# EAGLE design texboard (EAGLE 9.1.3)
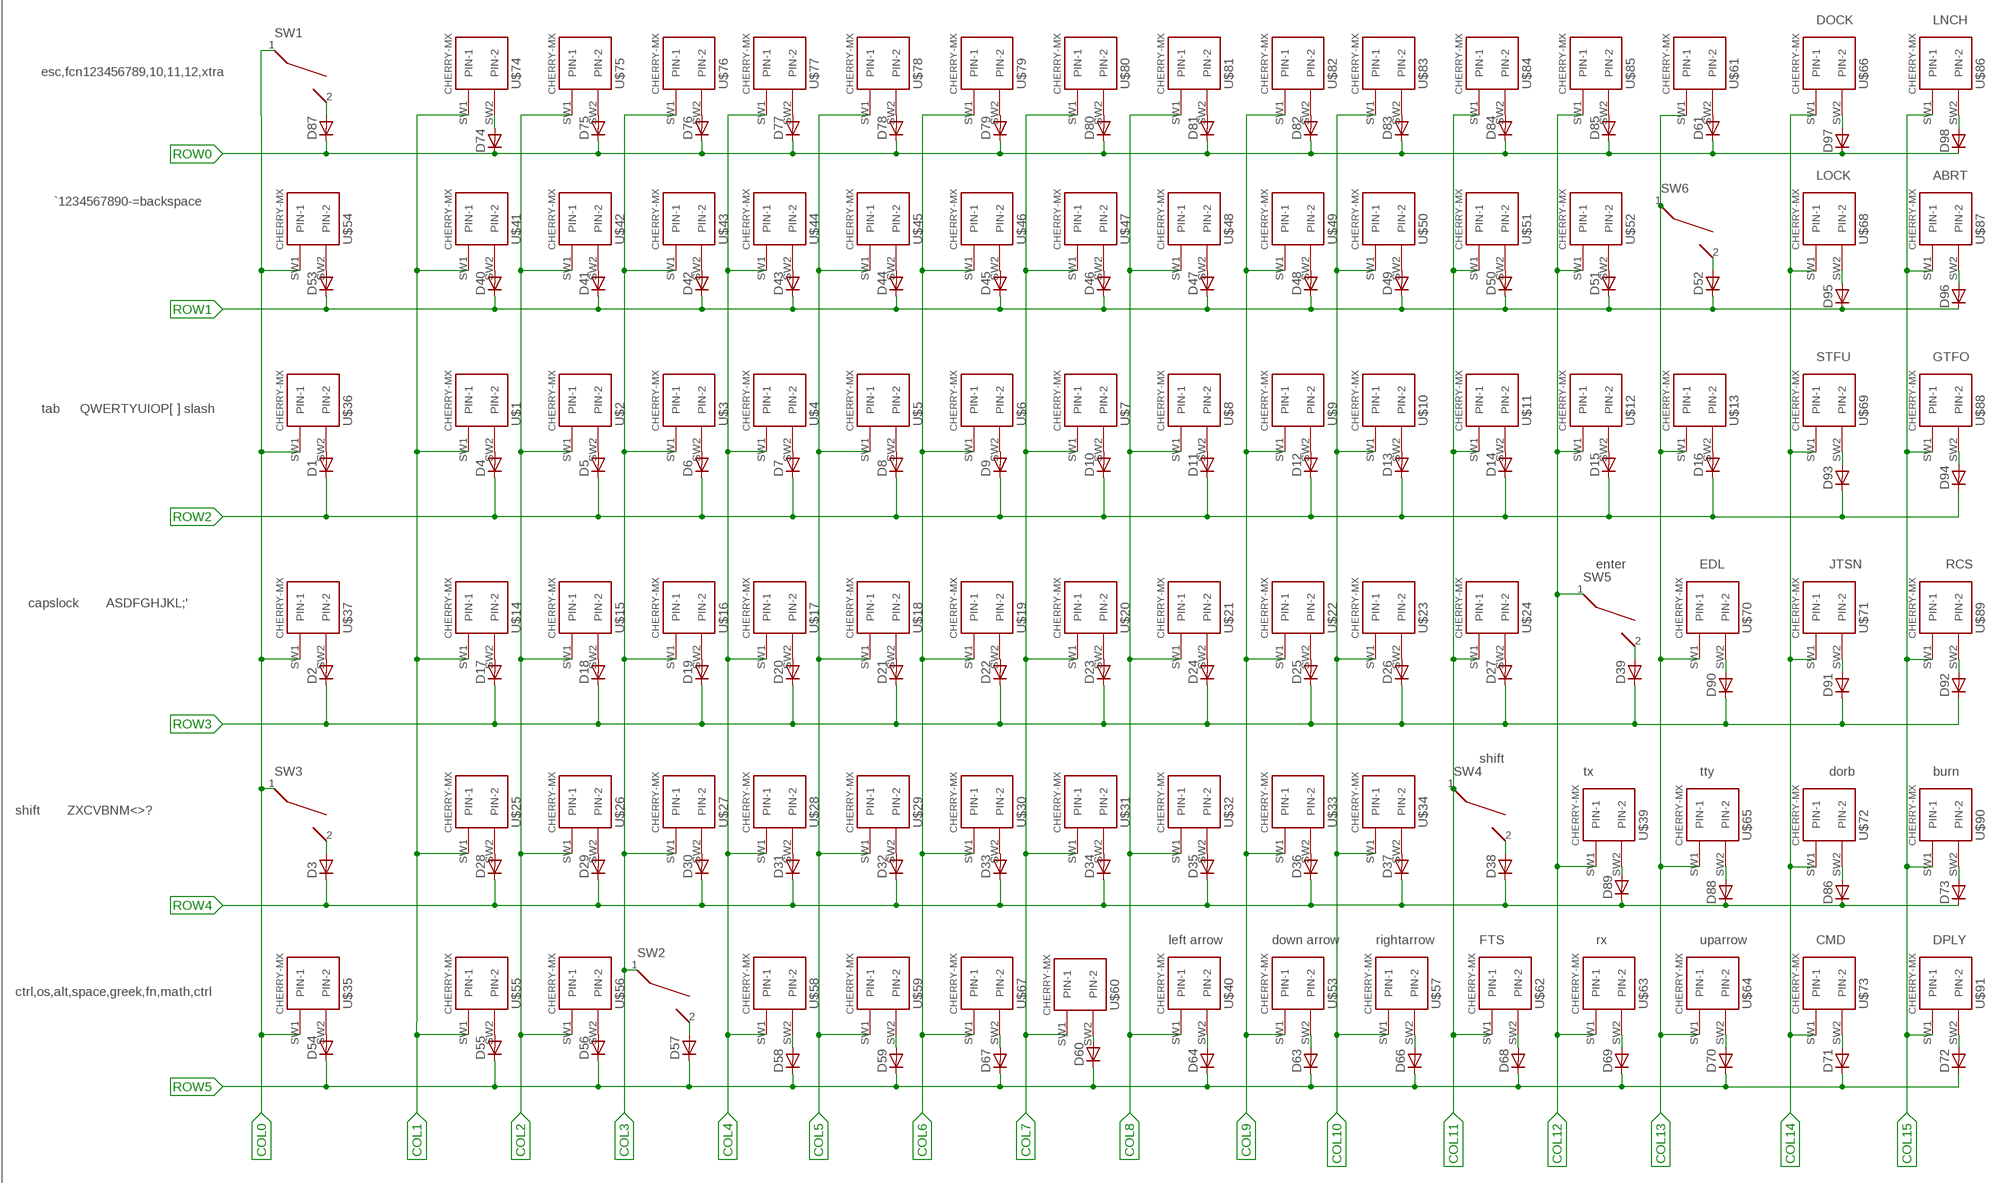
[diagram p0: schematic, sheet 1, part 1 of 2]
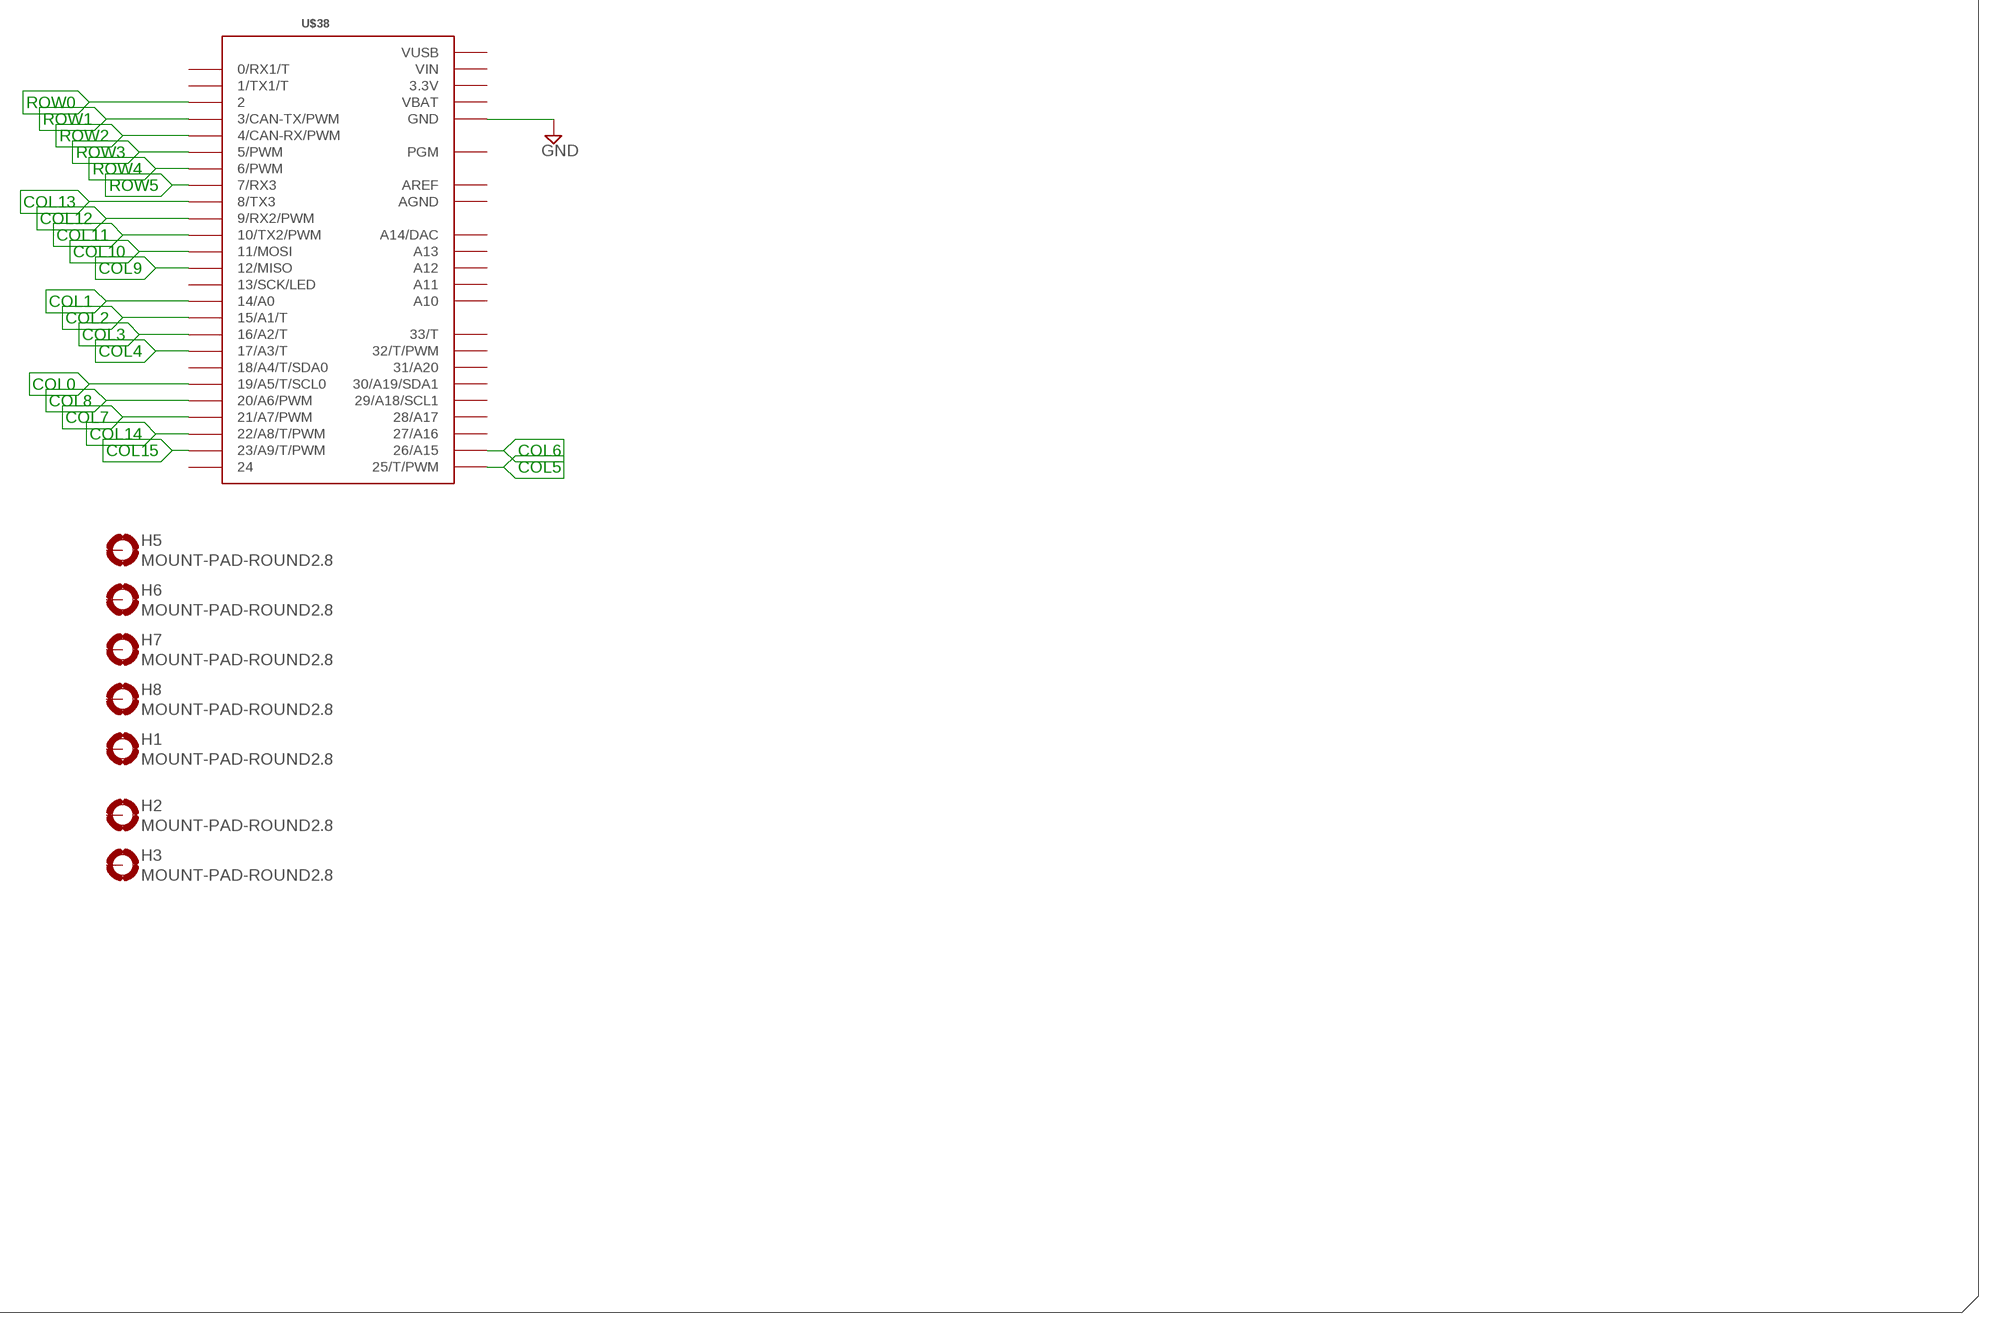
[diagram p1: schematic, sheet 1, part 2 of 2]

## Parts
D1  DIODE_E-DO35-7  [DIODE_DO35-7]
D2  DIODE_E-DO35-7  [DIODE_DO35-7]
D3  DIODE_E-DO35-7  [DIODE_DO35-7]
D4  DIODE_E-DO35-7  [DIODE_DO35-7]
D5  DIODE_E-DO35-7  [DIODE_DO35-7]
D6  DIODE_E-DO35-7  [DIODE_DO35-7]
D7  DIODE_E-DO35-7  [DIODE_DO35-7]
D8  DIODE_E-DO35-7  [DIODE_DO35-7]
D9  DIODE_E-DO35-7  [DIODE_DO35-7]
D10  DIODE_E-DO35-7  [DIODE_DO35-7]
D11  DIODE_E-DO35-7  [DIODE_DO35-7]
D12  DIODE_E-DO35-7  [DIODE_DO35-7]
D13  DIODE_E-DO35-7  [DIODE_DO35-7]
D14  DIODE_E-DO35-7  [DIODE_DO35-7]
D15  DIODE_E-DO35-7  [DIODE_DO35-7]
D16  DIODE_E-DO35-7  [DIODE_DO35-7]
D17  DIODE_E-DO35-7  [DIODE_DO35-7]
D18  DIODE_E-DO35-7  [DIODE_DO35-7]
D19  DIODE_E-DO35-7  [DIODE_DO35-7]
D20  DIODE_E-DO35-7  [DIODE_DO35-7]
D21  DIODE_E-DO35-7  [DIODE_DO35-7]
D22  DIODE_E-DO35-7  [DIODE_DO35-7]
D23  DIODE_E-DO35-7  [DIODE_DO35-7]
D24  DIODE_E-DO35-7  [DIODE_DO35-7]
D25  DIODE_E-DO35-7  [DIODE_DO35-7]
D26  DIODE_E-DO35-7  [DIODE_DO35-7]
D27  DIODE_E-DO35-7  [DIODE_DO35-7]
D28  DIODE_E-DO35-7  [DIODE_DO35-7]
D29  DIODE_E-DO35-7  [DIODE_DO35-7]
D30  DIODE_E-DO35-7  [DIODE_DO35-7]
D31  DIODE_E-DO35-7  [DIODE_DO35-7]
D32  DIODE_E-DO35-7  [DIODE_DO35-7]
D33  DIODE_E-DO35-7  [DIODE_DO35-7]
D34  DIODE_E-DO35-7  [DIODE_DO35-7]
D35  DIODE_E-DO35-7  [DIODE_DO35-7]
D36  DIODE_E-DO35-7  [DIODE_DO35-7]
D37  DIODE_E-DO35-7  [DIODE_DO35-7]
D38  DIODE_E-DO35-7  [DIODE_DO35-7]
D39  DIODE_E-DO35-7  [DIODE_DO35-7]
D40  DIODE_E-DO35-7  [DIODE_DO35-7]
D41  DIODE_E-DO35-7  [DIODE_DO35-7]
D42  DIODE_E-DO35-7  [DIODE_DO35-7]
D43  DIODE_E-DO35-7  [DIODE_DO35-7]
D44  DIODE_E-DO35-7  [DIODE_DO35-7]
D45  DIODE_E-DO35-7  [DIODE_DO35-7]
D46  DIODE_E-DO35-7  [DIODE_DO35-7]
D47  DIODE_E-DO35-7  [DIODE_DO35-7]
D48  DIODE_E-DO35-7  [DIODE_DO35-7]
D49  DIODE_E-DO35-7  [DIODE_DO35-7]
D50  DIODE_E-DO35-7  [DIODE_DO35-7]
D51  DIODE_E-DO35-7  [DIODE_DO35-7]
D52  DIODE_E-DO35-7  [DIODE_DO35-7]
D53  DIODE_E-DO35-7  [DIODE_DO35-7]
D54  DIODE_E-DO35-7  [DIODE_DO35-7]
D55  DIODE_E-DO35-7  [DIODE_DO35-7]
D56  DIODE_E-DO35-7  [DIODE_DO35-7]
D57  DIODE_E-DO35-7  [DIODE_DO35-7]
D58  DIODE_E-DO35-7  [DIODE_DO35-7]
D59  DIODE_E-DO35-7  [DIODE_DO35-7]
D60  DIODE_E-DO35-7  [DIODE_DO35-7]
D61  DIODE_E-DO35-7  [DIODE_DO35-7]
D63  DIODE_E-DO35-7  [DIODE_DO35-7]
D64  DIODE_E-DO35-7  [DIODE_DO35-7]
D66  DIODE_E-DO35-7  [DIODE_DO35-7]
D67  DIODE_E-DO35-7  [DIODE_DO35-7]
D68  DIODE_E-DO35-7  [DIODE_DO35-7]
D69  DIODE_E-DO35-7  [DIODE_DO35-7]
D70  DIODE_E-DO35-7  [DIODE_DO35-7]
D71  DIODE_E-DO35-7  [DIODE_DO35-7]
D72  DIODE_E-DO35-7  [DIODE_DO35-7]
D73  DIODE_E-DO35-7  [DIODE_DO35-7]
D74  DIODE_E-DO35-7  [DIODE_DO35-7]
D75  DIODE_E-DO35-7  [DIODE_DO35-7]
D76  DIODE_E-DO35-7  [DIODE_DO35-7]
D77  DIODE_E-DO35-7  [DIODE_DO35-7]
D78  DIODE_E-DO35-7  [DIODE_DO35-7]
D79  DIODE_E-DO35-7  [DIODE_DO35-7]
D80  DIODE_E-DO35-7  [DIODE_DO35-7]
D81  DIODE_E-DO35-7  [DIODE_DO35-7]
D82  DIODE_E-DO35-7  [DIODE_DO35-7]
D83  DIODE_E-DO35-7  [DIODE_DO35-7]
D84  DIODE_E-DO35-7  [DIODE_DO35-7]
D85  DIODE_E-DO35-7  [DIODE_DO35-7]
D86  DIODE_E-DO35-7  [DIODE_DO35-7]
D87  DIODE_E-DO35-7  [DIODE_DO35-7]
D88  DIODE_E-DO35-7  [DIODE_DO35-7]
D89  DIODE_E-DO35-7  [DIODE_DO35-7]
D90  DIODE_E-DO35-7  [DIODE_DO35-7]
D91  DIODE_E-DO35-7  [DIODE_DO35-7]
D92  DIODE_E-DO35-7  [DIODE_DO35-7]
D93  DIODE_E-DO35-7  [DIODE_DO35-7]
D94  DIODE_E-DO35-7  [DIODE_DO35-7]
D95  DIODE_E-DO35-7  [DIODE_DO35-7]
D96  DIODE_E-DO35-7  [DIODE_DO35-7]
D97  DIODE_E-DO35-7  [DIODE_DO35-7]
D98  DIODE_E-DO35-7  [DIODE_DO35-7]
H1  MOUNT-PAD-ROUND2.8  [2,8-PAD]
H2  MOUNT-PAD-ROUND2.8  [2,8-PAD]
H3  MOUNT-PAD-ROUND2.8  [2,8-PAD]
H5  MOUNT-PAD-ROUND2.8  [2,8-PAD]
H6  MOUNT-PAD-ROUND2.8  [2,8-PAD]
H7  MOUNT-PAD-ROUND2.8  [2,8-PAD]
H8  MOUNT-PAD-ROUND2.8  [2,8-PAD]
SW1  CHERRY_MX_STABILIZER_2X  [MX1A-XXNN_WITH_STABILIZER_2X]
SW2  CHERRY_MX_WITH_FIXING_PINS_&_STABILIZER_6.25X  [MX1A-XXNW_WITH_STABILIZER_6.25X]
SW3  CHERRY_MX_STABILIZER_2X  [MX1A-XXNN_WITH_STABILIZER_2X]
SW4  CHERRY_MX_STABILIZER_2X  [MX1A-XXNN_WITH_STABILIZER_2X]
SW5  CHERRY_MX_STABILIZER_2X  [MX1A-XXNN_WITH_STABILIZER_2X]
SW6  CHERRY_MX_STABILIZER_2X  [MX1A-XXNN_WITH_STABILIZER_2X]
U$1  CHERRY-MX  [CHERRY-MX]
U$2  CHERRY-MX  [CHERRY-MX]
U$3  CHERRY-MX  [CHERRY-MX]
U$4  CHERRY-MX  [CHERRY-MX]
U$5  CHERRY-MX  [CHERRY-MX]
U$6  CHERRY-MX  [CHERRY-MX]
U$7  CHERRY-MX  [CHERRY-MX]
U$8  CHERRY-MX  [CHERRY-MX]
U$9  CHERRY-MX  [CHERRY-MX]
U$10  CHERRY-MX  [CHERRY-MX]
U$11  CHERRY-MX  [CHERRY-MX]
U$12  CHERRY-MX  [CHERRY-MX]
U$13  CHERRY-MX  [CHERRY-MX]
U$14  CHERRY-MX  [CHERRY-MX]
U$15  CHERRY-MX  [CHERRY-MX]
U$16  CHERRY-MX  [CHERRY-MX]
U$17  CHERRY-MX  [CHERRY-MX]
U$18  CHERRY-MX  [CHERRY-MX]
U$19  CHERRY-MX  [CHERRY-MX]
U$20  CHERRY-MX  [CHERRY-MX]
U$21  CHERRY-MX  [CHERRY-MX]
U$22  CHERRY-MX  [CHERRY-MX]
U$23  CHERRY-MX  [CHERRY-MX]
U$24  CHERRY-MX  [CHERRY-MX]
U$25  CHERRY-MX  [CHERRY-MX]
U$26  CHERRY-MX  [CHERRY-MX]
U$27  CHERRY-MX  [CHERRY-MX]
U$28  CHERRY-MX  [CHERRY-MX]
U$29  CHERRY-MX  [CHERRY-MX]
U$30  CHERRY-MX  [CHERRY-MX]
U$31  CHERRY-MX  [CHERRY-MX]
U$32  CHERRY-MX  [CHERRY-MX]
U$33  CHERRY-MX  [CHERRY-MX]
U$34  CHERRY-MX  [CHERRY-MX]
U$35  CHERRY-MX  [CHERRY-MX]
U$36  CHERRY-MX  [CHERRY-MX]
U$37  CHERRY-MX  [CHERRY-MX]
U$38  TEENSY_3.1-3.2_ALL_PINS&PADS  [TEENSY_3.0-3.2_ALL_PINS_&_PADS]
U$39  CHERRY-MX  [CHERRY-MX]
U$40  CHERRY-MX  [CHERRY-MX]
U$41  CHERRY-MX  [CHERRY-MX]
U$42  CHERRY-MX  [CHERRY-MX]
U$43  CHERRY-MX  [CHERRY-MX]
U$44  CHERRY-MX  [CHERRY-MX]
U$45  CHERRY-MX  [CHERRY-MX]
U$46  CHERRY-MX  [CHERRY-MX]
U$47  CHERRY-MX  [CHERRY-MX]
U$48  CHERRY-MX  [CHERRY-MX]
U$49  CHERRY-MX  [CHERRY-MX]
U$50  CHERRY-MX  [CHERRY-MX]
U$51  CHERRY-MX  [CHERRY-MX]
U$52  CHERRY-MX  [CHERRY-MX]
U$53  CHERRY-MX  [CHERRY-MX]
U$54  CHERRY-MX  [CHERRY-MX]
U$55  CHERRY-MX  [CHERRY-MX]
U$56  CHERRY-MX  [CHERRY-MX]
U$57  CHERRY-MX  [CHERRY-MX]
U$58  CHERRY-MX  [CHERRY-MX]
U$59  CHERRY-MX  [CHERRY-MX]
U$60  CHERRY-MX  [CHERRY-MX]
U$61  CHERRY-MX  [CHERRY-MX]
U$62  CHERRY-MX  [CHERRY-MX]
U$63  CHERRY-MX  [CHERRY-MX]
U$64  CHERRY-MX  [CHERRY-MX]
U$65  CHERRY-MX  [CHERRY-MX]
U$66  CHERRY-MX  [CHERRY-MX]
U$67  CHERRY-MX  [CHERRY-MX]
U$68  CHERRY-MX  [CHERRY-MX]
U$69  CHERRY-MX  [CHERRY-MX]
U$70  CHERRY-MX  [CHERRY-MX]
U$71  CHERRY-MX  [CHERRY-MX]
U$72  CHERRY-MX  [CHERRY-MX]
U$73  CHERRY-MX  [CHERRY-MX]
U$74  CHERRY-MX  [CHERRY-MX]
U$75  CHERRY-MX  [CHERRY-MX]
U$76  CHERRY-MX  [CHERRY-MX]
U$77  CHERRY-MX  [CHERRY-MX]
U$78  CHERRY-MX  [CHERRY-MX]
U$79  CHERRY-MX  [CHERRY-MX]
U$80  CHERRY-MX  [CHERRY-MX]
U$81  CHERRY-MX  [CHERRY-MX]
U$82  CHERRY-MX  [CHERRY-MX]
U$83  CHERRY-MX  [CHERRY-MX]
U$84  CHERRY-MX  [CHERRY-MX]
U$85  CHERRY-MX  [CHERRY-MX]
U$86  CHERRY-MX  [CHERRY-MX]
U$87  CHERRY-MX  [CHERRY-MX]
U$88  CHERRY-MX  [CHERRY-MX]
U$89  CHERRY-MX  [CHERRY-MX]
U$90  CHERRY-MX  [CHERRY-MX]
U$91  CHERRY-MX  [CHERRY-MX]

## Nets
COL0: SW1.1 SW3.1 U$35.SW1(PIN-1) U$36.SW1(PIN-1) U$37.SW1(PIN-1) U$38.19/A5(19/A5/T/SCL0) U$54.SW1(PIN-1)
COL1: U$1.SW1(PIN-1) U$14.SW1(PIN-1) U$25.SW1(PIN-1) U$38.14/A0 U$41.SW1(PIN-1) U$55.SW1(PIN-1) U$74.SW1(PIN-1)
COL2: U$2.SW1(PIN-1) U$15.SW1(PIN-1) U$26.SW1(PIN-1) U$38.15/A1(15/A1/T) U$42.SW1(PIN-1) U$56.SW1(PIN-1) U$75.SW1(PIN-1)
COL3: SW2.1 U$3.SW1(PIN-1) U$16.SW1(PIN-1) U$27.SW1(PIN-1) U$38.16/A2(16/A2/T) U$43.SW1(PIN-1) U$76.SW1(PIN-1)
COL4: U$4.SW1(PIN-1) U$17.SW1(PIN-1) U$28.SW1(PIN-1) U$38.17/A3(17/A3/T) U$44.SW1(PIN-1) U$58.SW1(PIN-1) U$77.SW1(PIN-1)
COL5: U$5.SW1(PIN-1) U$18.SW1(PIN-1) U$29.SW1(PIN-1) U$38.25(25/T/PWM) U$45.SW1(PIN-1) U$59.SW1(PIN-1) U$78.SW1(PIN-1)
COL6: U$6.SW1(PIN-1) U$19.SW1(PIN-1) U$30.SW1(PIN-1) U$38.26(26/A15) U$46.SW1(PIN-1) U$67.SW1(PIN-1) U$79.SW1(PIN-1)
COL7: U$7.SW1(PIN-1) U$20.SW1(PIN-1) U$31.SW1(PIN-1) U$38.21/A7(21/A7/PWM) U$47.SW1(PIN-1) U$60.SW1(PIN-1) U$80.SW1(PIN-1)
COL8: U$8.SW1(PIN-1) U$21.SW1(PIN-1) U$32.SW1(PIN-1) U$38.20/A6(20/A6/PWM) U$40.SW1(PIN-1) U$48.SW1(PIN-1) U$81.SW1(PIN-1)
COL9: U$9.SW1(PIN-1) U$22.SW1(PIN-1) U$33.SW1(PIN-1) U$38.12(12/MISO) U$49.SW1(PIN-1) U$53.SW1(PIN-1) U$82.SW1(PIN-1)
COL10: U$10.SW1(PIN-1) U$23.SW1(PIN-1) U$34.SW1(PIN-1) U$38.11(11/MOSI) U$50.SW1(PIN-1) U$57.SW1(PIN-1) U$83.SW1(PIN-1)
COL11: SW4.1 U$11.SW1(PIN-1) U$24.SW1(PIN-1) U$38.10(10/TX2/PWM) U$51.SW1(PIN-1) U$62.SW1(PIN-1) U$84.SW1(PIN-1)
COL12: SW5.1 U$12.SW1(PIN-1) U$38.9(9/RX2/PWM) U$39.SW1(PIN-1) U$52.SW1(PIN-1) U$63.SW1(PIN-1) U$85.SW1(PIN-1)
COL13: SW6.1 U$13.SW1(PIN-1) U$38.8(8/TX3) U$61.SW1(PIN-1) U$64.SW1(PIN-1) U$65.SW1(PIN-1) U$70.SW1(PIN-1)
COL14: U$38.22/A8(22/A8/T/PWM) U$66.SW1(PIN-1) U$68.SW1(PIN-1) U$69.SW1(PIN-1) U$71.SW1(PIN-1) U$72.SW1(PIN-1) U$73.SW1(PIN-1)
COL15: U$38.23/A9(23/A9/T/PWM) U$86.SW1(PIN-1) U$87.SW1(PIN-1) U$88.SW1(PIN-1) U$89.SW1(PIN-1) U$90.SW1(PIN-1) U$91.SW1(PIN-1)
GND: U$38.GND U$38.GND1(GND) U$38.GND2(GND)
N$1: D4.A(C) U$1.SW2(PIN-2)
N$2: D5.A(C) U$2.SW2(PIN-2)
N$3: D6.A(C) U$3.SW2(PIN-2)
N$4: D7.A(C) U$4.SW2(PIN-2)
N$5: D8.A(C) U$5.SW2(PIN-2)
N$6: D9.A(C) U$6.SW2(PIN-2)
N$7: D10.A(C) U$7.SW2(PIN-2)
N$8: D11.A(C) U$8.SW2(PIN-2)
N$9: D12.A(C) U$9.SW2(PIN-2)
N$10: D13.A(C) U$10.SW2(PIN-2)
N$11: D14.A(C) U$11.SW2(PIN-2)
N$12: D15.A(C) U$12.SW2(PIN-2)
N$13: D16.A(C) U$13.SW2(PIN-2)
N$14: D17.A(C) U$14.SW2(PIN-2)
N$15: D18.A(C) U$15.SW2(PIN-2)
N$16: D19.A(C) U$16.SW2(PIN-2)
N$17: D20.A(C) U$17.SW2(PIN-2)
N$18: D21.A(C) U$18.SW2(PIN-2)
N$19: D22.A(C) U$19.SW2(PIN-2)
N$20: D23.A(C) U$20.SW2(PIN-2)
N$21: D24.A(C) U$21.SW2(PIN-2)
N$22: D25.A(C) U$22.SW2(PIN-2)
N$23: D26.A(C) U$23.SW2(PIN-2)
N$24: D27.A(C) U$24.SW2(PIN-2)
N$25: D28.A(C) U$25.SW2(PIN-2)
N$26: D29.A(C) U$26.SW2(PIN-2)
N$27: D30.A(C) U$27.SW2(PIN-2)
N$28: D31.A(C) U$28.SW2(PIN-2)
N$29: D32.A(C) U$29.SW2(PIN-2)
N$30: D33.A(C) U$30.SW2(PIN-2)
N$31: D34.A(C) U$31.SW2(PIN-2)
N$32: D35.A(C) U$32.SW2(PIN-2)
N$33: D36.A(C) U$33.SW2(PIN-2)
N$34: D37.A(C) U$34.SW2(PIN-2)
N$35: D60.A(C) U$60.SW2(PIN-2)
N$36: D61.A(C) U$61.SW2(PIN-2)
N$39: D57.A(C) SW2.2
N$40: D97.A(C) U$66.SW2(PIN-2)
N$41: D67.A(C) U$67.SW2(PIN-2)
N$42: D98.A(C) U$86.SW2(PIN-2)
N$44: D87.A(C) SW1.2
N$46: D69.A(C) U$63.SW2(PIN-2)
N$47: D68.A(C) U$62.SW2(PIN-2)
N$48: D66.A(C) U$57.SW2(PIN-2)
N$49: D63.A(C) U$53.SW2(PIN-2)
N$50: D64.A(C) U$40.SW2(PIN-2)
N$51: D1.A(C) U$36.SW2(PIN-2)
N$52: D2.A(C) U$37.SW2(PIN-2)
N$53: D3.A(C) SW3.2
N$54: D38.A(C) SW4.2
N$55: D39.A(C) SW5.2
N$56: D40.A(C) U$41.SW2(PIN-2)
N$57: D41.A(C) U$42.SW2(PIN-2)
N$58: D42.A(C) U$43.SW2(PIN-2)
N$59: D43.A(C) U$44.SW2(PIN-2)
N$60: D44.A(C) U$45.SW2(PIN-2)
N$61: D45.A(C) U$46.SW2(PIN-2)
N$62: D46.A(C) U$47.SW2(PIN-2)
N$63: D47.A(C) U$48.SW2(PIN-2)
N$64: D48.A(C) U$49.SW2(PIN-2)
N$65: D49.A(C) U$50.SW2(PIN-2)
N$66: D50.A(C) U$51.SW2(PIN-2)
N$67: D51.A(C) U$52.SW2(PIN-2)
N$68: D52.A(C) SW6.2
N$70: D54.A(C) U$35.SW2(PIN-2)
N$71: D55.A(C) U$55.SW2(PIN-2)
N$72: D56.A(C) U$56.SW2(PIN-2)
N$73: D70.A(C) U$64.SW2(PIN-2)
N$74: D58.A(C) U$58.SW2(PIN-2)
N$75: D59.A(C) U$59.SW2(PIN-2)
N$76: D71.A(C) U$73.SW2(PIN-2)
N$77: D72.A(C) U$91.SW2(PIN-2)
N$78: D89.A(C) U$39.SW2(PIN-2)
N$79: D88.A(C) U$65.SW2(PIN-2)
N$80: D86.A(C) U$72.SW2(PIN-2)
N$81: D73.A(C) U$90.SW2(PIN-2)
N$82: D91.A(C) U$71.SW2(PIN-2)
N$83: D53.A(C) U$54.SW2(PIN-2)
N$84: D92.A(C) U$89.SW2(PIN-2)
N$91: D90.A(C) U$70.SW2(PIN-2)
N$92: D94.A(C) U$88.SW2(PIN-2)
N$93: D93.A(C) U$69.SW2(PIN-2)
N$95: D95.A(C) U$68.SW2(PIN-2)
N$96: D96.A(C) U$87.SW2(PIN-2)
N$119: D74.A(C) U$74.SW2(PIN-2)
N$120: D75.A(C) U$75.SW2(PIN-2)
N$121: D76.A(C) U$76.SW2(PIN-2)
N$122: D77.A(C) U$77.SW2(PIN-2)
N$123: D78.A(C) U$78.SW2(PIN-2)
N$124: D79.A(C) U$79.SW2(PIN-2)
N$125: D80.A(C) U$80.SW2(PIN-2)
N$126: D81.A(C) U$81.SW2(PIN-2)
N$127: D82.A(C) U$82.SW2(PIN-2)
N$128: D83.A(C) U$83.SW2(PIN-2)
N$129: D84.A(C) U$84.SW2(PIN-2)
N$130: D85.A(C) U$85.SW2(PIN-2)
ROW0: D61.C(A) D74.C(A) D75.C(A) D76.C(A) D77.C(A) D78.C(A) D79.C(A) D80.C(A) D81.C(A) D82.C(A) D83.C(A) D84.C(A) D85.C(A) D87.C(A) D97.C(A) D98.C(A) U$38.2
ROW1: D40.C(A) D41.C(A) D42.C(A) D43.C(A) D44.C(A) D45.C(A) D46.C(A) D47.C(A) D48.C(A) D49.C(A) D50.C(A) D51.C(A) D52.C(A) D53.C(A) D95.C(A) D96.C(A) U$38.3(3/CAN-TX/PWM)
ROW2: D1.C(A) D4.C(A) D5.C(A) D6.C(A) D7.C(A) D8.C(A) D9.C(A) D10.C(A) D11.C(A) D12.C(A) D13.C(A) D14.C(A) D15.C(A) D16.C(A) D93.C(A) D94.C(A) U$38.4(4/CAN-RX/PWM)
ROW3: D2.C(A) D17.C(A) D18.C(A) D19.C(A) D20.C(A) D21.C(A) D22.C(A) D23.C(A) D24.C(A) D25.C(A) D26.C(A) D27.C(A) D39.C(A) D90.C(A) D91.C(A) D92.C(A) U$38.5(5/PWM)
ROW4: D3.C(A) D28.C(A) D29.C(A) D30.C(A) D31.C(A) D32.C(A) D33.C(A) D34.C(A) D35.C(A) D36.C(A) D37.C(A) D38.C(A) D73.C(A) D86.C(A) D88.C(A) D89.C(A) U$38.6(6/PWM)
ROW5: D54.C(A) D55.C(A) D56.C(A) D57.C(A) D58.C(A) D59.C(A) D60.C(A) D63.C(A) D64.C(A) D66.C(A) D67.C(A) D68.C(A) D69.C(A) D70.C(A) D71.C(A) D72.C(A) U$38.7(7/RX3)
Unconnected: H1.B2,8(MOUNT) H2.B2,8(MOUNT) H3.B2,8(MOUNT) H5.B2,8(MOUNT) H6.B2,8(MOUNT) H7.B2,8(MOUNT) H8.B2,8(MOUNT) U$38.0(0/RX1/T) U$38.1(1/TX1/T) U$38.13(13/SCK/LED) U$38.18/A4(18/A4/T/SDA0) U$38.24 U$38.27(27/A16) U$38.28(28/A17) U$38.29(29/A18/SCL1) U$38.30(30/A19/SDA1) U$38.31(31/A20) U$38.32(32/T/PWM) U$38.33(33/T) U$38.A10 U$38.A11 U$38.A12 U$38.A13 U$38.PGM U$38.RESET/DAC(A14/DAC)

## Notes on the sheet
- DOCK | LNCH
- esc,fcn123456789,10,11,12,xtra
- LOCK | ABRT
- `1234567890-=backspace
- STFU | GTFO
- tab | QWERTYUIOP[ ] slash
- enter | EDL | JTSN | RCS
- capslock | ASDFGHJKL;'
- shift
- tx | tty | dorb | burn
- shift | ZXCVBNM<>?
- left arrow | down arrow | rightarrow | FTS | rx | uparrow | CMD | DPLY
- ctrl,os,alt,space,greek,fn,math,ctrl

## Power pins joined to a net without a drawn wire
3.3V: U$38.3.3V U$38.3.3V1(3.3V) U$38.3.3V2(3.3V)
AGND: U$38.AGND
AREF: U$38.AREF
VBAT: U$38.VBAT
VIN: U$38.VIN
VUSB: U$38.VUSB

## Library data of the parts
D1-D61 D63 D64 D66-D98 = eagle-ltspice:DIODE_E-: Schottky Diode; SPICEMODEL: diode; SPICEPREFIX: D
H1-H3 H5-H8 = holes:MOUNT-PAD-ROUND: MOUNTING PAD, round
SW1-SW6 = Cherry_MX_v7.0:CHERRY_MX
U$1-U$37 U$39-U$91 = cherrymx:CHERRY-MX: Cherry MX series keyswitch
U$38 = Teensy_3_and_LC_Series_Boards_v1.4:TEENSY_3.1-3.2_ALL_PINS&PADS: Footprint for Teensy 3.1 or 3.2 board using all pads and all through-holes. Pads need a 2x7 0.1" SMD header.

## Board
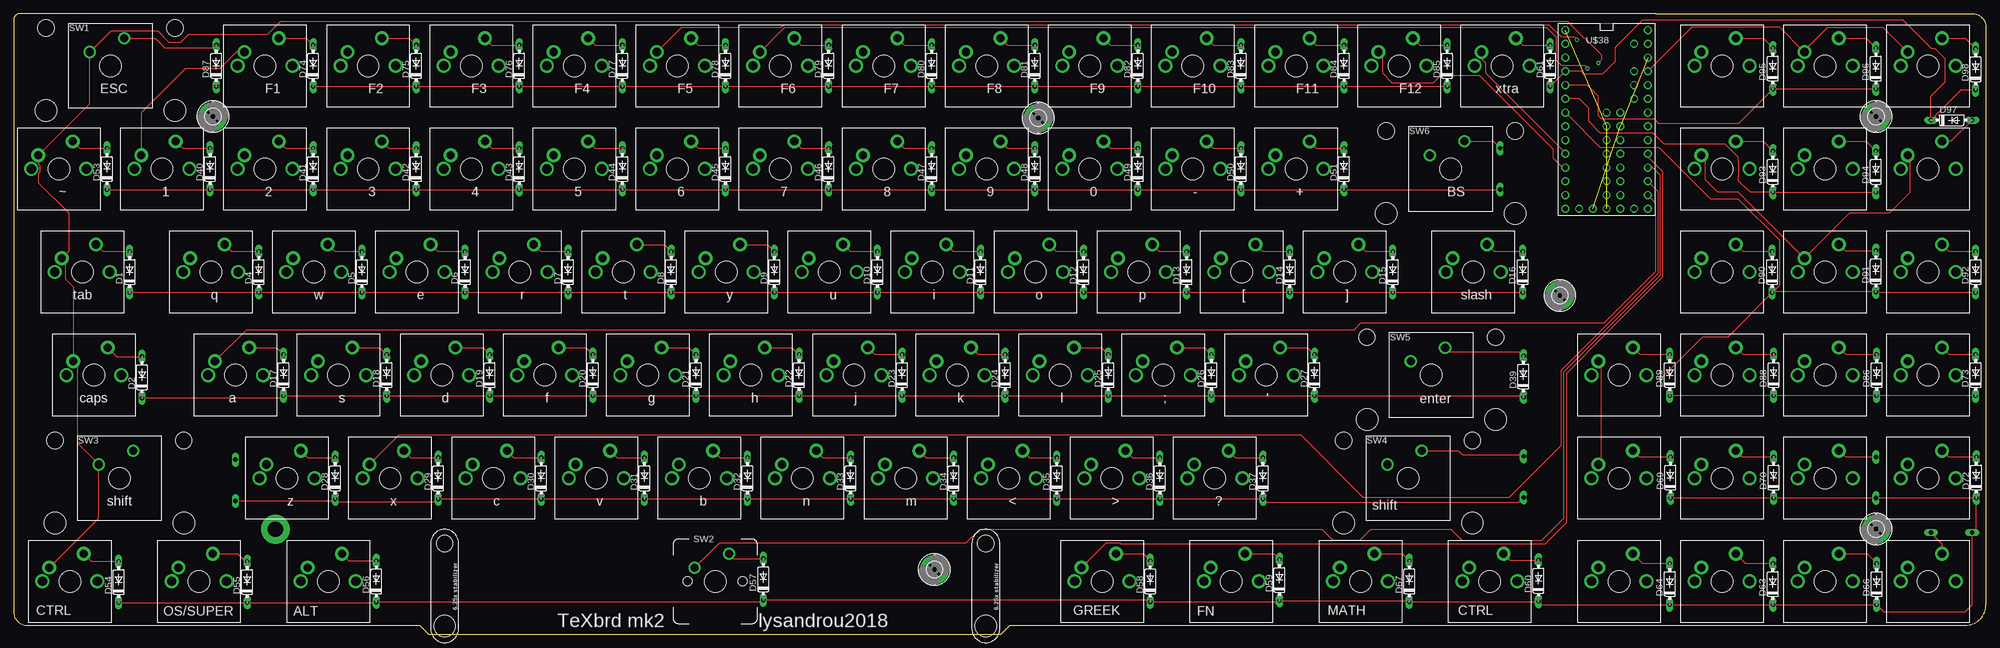
[diagram p2: board, top side]
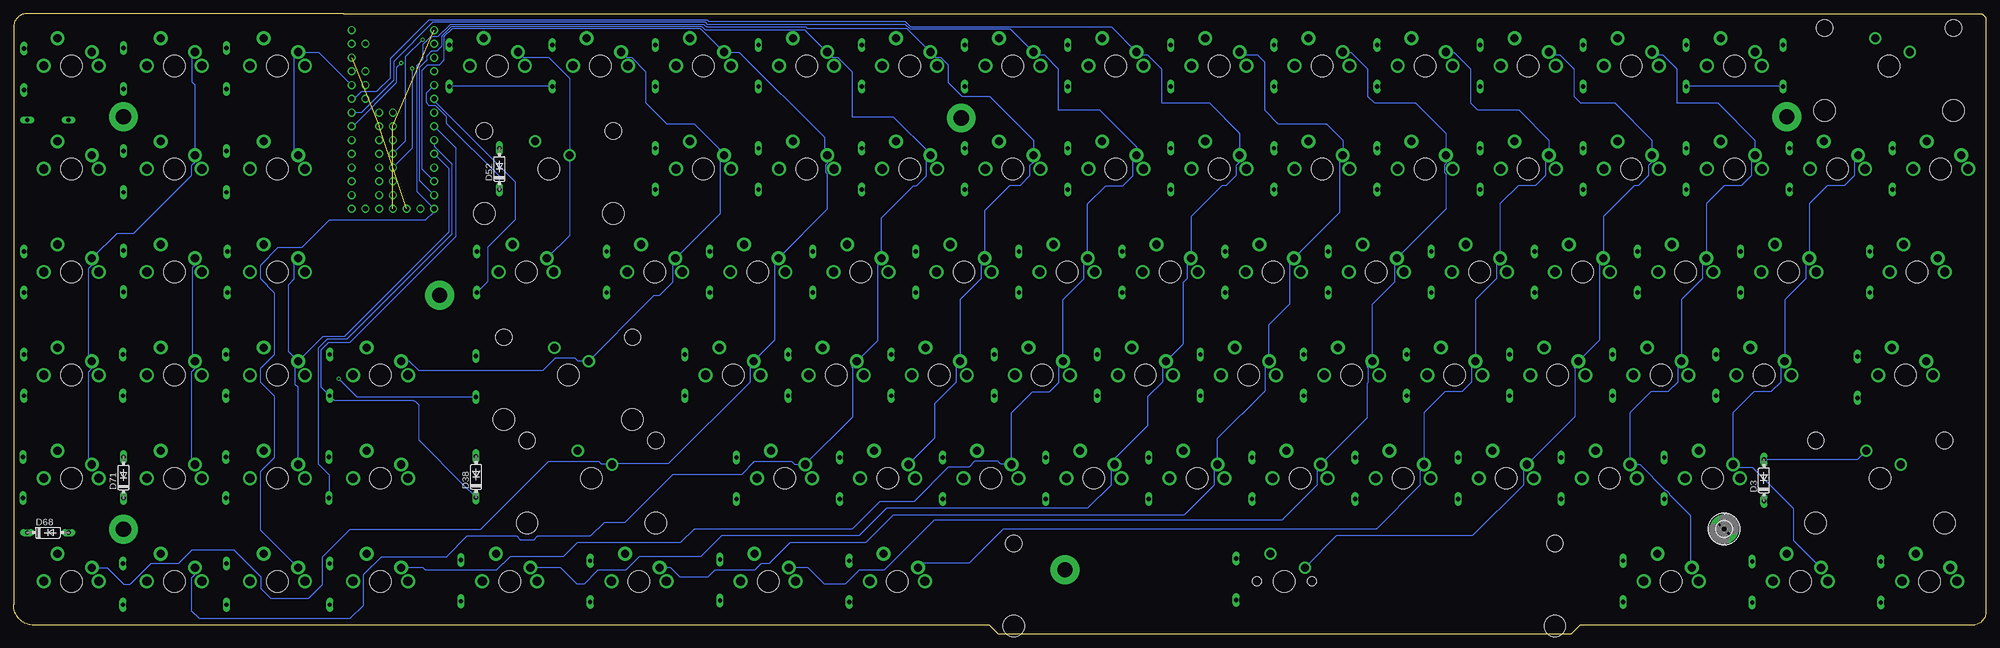
[diagram p3: board, bottom side, seen from below]

Size 364.49 x 114.68 mm. Coordinates in mm from the lower left corner, seen from the top.
Outline: 303.53,114.68 1.27,114.68 arc90 0,113.41 0,4.19 arc90 2.54,1.65 75.06,1.65 76.71,0 182.5,0 184.15,1.65 360.68,1.65 arc90 364.49,5.46 364.49,112.14 arc90 361.95,114.68 303.53,114.68
Copper layers (1*16): Top 0.035mm / dielectric 1.5mm / Bottom 0.035mm
Design rules "default": minimum track width 6mil, minimum drill 0.35mm, track to track 6mil, track to pad 6mil, pad to pad 6mil, via to via 6mil, smd to smd 6mil, copper to edge 40mil, drill to drill 6mil, minimum pad ring 10mil, minimum via ring 8mil, stop-mask expansion 4mil, vias tented up to drill 0mil, thermal gap 10mil

### Footprints (pad centres in the part's own frame; a part is rotated, then mirrored left to right if it is on the bottom)
DIODE_DO35-7 = drill 0.813 long: A 3.81,0; C -3.81,0
2,8-PAD = drill 2.8 pad 5.334: B2,8 0,0
MX1A-XXNN_WITH_STABILIZER_2X = drill 1.5: 1 -3.81,2.54; 2 2.54,5.08 | hole 4: 0,0; 11.9,-8.24; -11.9,-8.24 | hole 3.05: -11.9,7; 11.9,7
MX1A-XXNW_WITH_STABILIZER_6.25X = drill 1.5: 1 -3.81,2.54; 2 2.54,5.08 | hole 4: 0,0; 50,-8.24; -50,-8.24 | hole 1.7: -5.08,0; 5.08,0 | hole 3.05: -50,7; 50,7
CHERRY-MX = drill 1.714 pad 1.93: P$3 -5.08,0; P$4 5.08,0 | drill 1.5 pad 2.54: SW1 -3.81,2.54; SW2 2.54,5.08 | hole 4: 0,0
TEENSY_3.0-3.2_ALL_PINS_&_PADS = drill 0.965: 0 -7.62,13.97; 1 -7.62,11.43; 2 -7.62,8.89; 3 -7.62,6.35; 3.3V 7.62,11.43; 3.3V1 -2.54,-16.51; 3.3V2 2.54,-1.27; 4 -7.62,3.81; 5 -7.62,1.27; 6 -7.62,-1.27; 7 -7.62,-3.81; 8 -7.62,-6.35; 9 -7.62,-8.89; 10 -7.62,-11.43; 11 -7.62,-13.97; 12 -7.62,-16.51; 13 7.62,-16.51; 14/A0 7.62,-13.97; 15/A1 7.62,-11.43; 16/A2 7.62,-8.89; 17/A3 7.62,-6.35; 18/A4 7.62,-3.81; 19/A5 7.62,-1.27; 20/A6 7.62,1.27; 21/A7 7.62,3.81; 22/A8 7.62,6.35; 23/A9 7.62,8.89; 24 0,-3.81; 25 0,-6.35; 26 0,-8.89; 27 0,-11.43; 28 0,-13.97; 29 2.54,-13.97; 30 2.54,-11.43; 31 2.54,-8.89; 32 2.54,-6.35; 33 2.54,-3.81; A10 5.08,6.35; A11 5.08,3.81; A12 0,1.27; A13 2.54,1.27; AGND 7.62,13.97; AREF 5.08,8.89; GND -7.62,16.51; GND1 0,-16.51; GND2 0,-1.27; PGM 2.54,-16.51; RESET/DAC 5.08,-16.51; VBAT -5.08,-16.51; VIN 7.62,16.51; VUSB 5.08,13.97

### Placement (x,y rotation side)
D1  21.46,66.93 90 top
D2  23.75,47.5 90 top
D3  41.02,28.45 90 bottom
D4  45.34,66.93 90 top
D5  64.39,66.93 90 top
D6  83.44,66.93 90 top
D7  102.49,66.93 90 top
D8  121.54,66.93 90 top
D9  140.59,66.93 90 top
D10  159.64,66.93 90 top
D11  178.69,66.93 90 top
D12  197.74,66.93 90 top
D13  216.79,66.93 90 top
D14  235.84,66.93 90 top
D15  254.89,66.93 90 top
D16  278.89,66.93 90 top
D17  49.91,47.88 90 top
D18  68.96,47.88 90 top
D19  88.01,47.88 90 top
D20  107.06,47.88 90 top
D21  126.11,47.88 90 top
D22  145.16,47.88 90 top
D23  164.21,47.88 90 top
D24  183.26,47.88 90 top
D25  202.31,47.88 90 top
D26  221.36,47.88 90 top
D27  240.41,47.88 90 top
D28  59.44,28.83 90 top
D29  78.49,28.83 90 top
D30  97.54,28.83 90 top
D31  116.59,28.83 90 top
D32  135.64,28.83 90 top
D33  154.69,28.83 90 top
D34  173.74,28.83 90 top
D35  192.79,28.83 90 top
D36  211.84,28.83 90 top
D37  230.89,28.83 90 top
D38  279.02,29.08 90 bottom
D39  279.02,47.62 90 top
D40  36.32,85.98 90 top
D41  55.37,85.98 90 top
D42  74.42,85.98 90 top
D43  93.47,85.98 90 top
D44  112.52,85.98 90 top
D45  131.57,85.98 90 top
D46  150.62,85.98 90 top
D47  169.67,85.98 90 top
D48  188.72,85.98 90 top
D49  207.77,85.98 90 top
D50  226.82,85.98 90 top
D51  245.87,85.98 90 top
D52  274.7,85.98 90 bottom
D53  17.27,85.98 90 top
D54  19.43,9.65 90 top
D55  43.18,9.65 90 top
D56  67.06,9.78 90 top
D57  138.56,10.16 90 top
D58  210.06,9.78 90 top
D59  233.93,10.03 90 top
D60  281.81,9.91 90 top
D61  283.97,105.03 90 top
D63  325.12,9.27 90 top
D64  306.07,9.27 90 top
D66  344.3,9.27 90 top
D67  257.94,9.78 90 top
D68  358.14,18.8 0 bottom
D69  306.2,28.96 90 top
D70  325.25,28.96 90 top
D71  344.17,28.96 90 bottom
D72  362.71,28.96 90 top
D73  362.58,47.88 90 top
D74  55.37,105.03 90 top
D75  74.42,105.03 90 top
D76  93.47,105.03 90 top
D77  112.52,105.03 90 top
D78  131.57,105.03 90 top
D79  150.62,105.03 90 top
D80  169.67,105.03 90 top
D81  188.72,105.03 90 top
D82  207.77,105.03 90 top
D83  226.82,105.03 90 top
D84  245.87,105.03 90 top
D85  264.92,105.03 90 top
D86  344.3,47.88 90 top
D87  37.47,105.03 90 top
D88  325.25,47.88 90 top
D89  306.07,47.88 90 top
D90  324.99,66.93 90 top
D91  344.17,67.06 90 top
D92  362.58,66.93 90 top
D93  325.12,85.47 90 top
D94  344.17,85.47 90 top
D95  325.12,104.52 90 top
D96  344.17,104.52 90 top
D97  358.14,95 0 top
D98  362.58,104.39 90 top
H1  344.17,19.43 0 top
H2  285.75,62.61 0 top
H3  344.17,95.63 0 top
H5  36.83,95.63 0 top
H6  170.18,11.94 0 top
H7  189.36,95.38 0 top
H8  48.39,19.43 0 bottom
SW1  17.91,105.03 0 top
SW2  129.67,9.78 0 top
SW3  19.56,28.83 0 top
SW4  257.68,28.83 0 top
SW5  262,47.88 0 top
SW6  265.56,85.98 0 top
U$1  36.45,66.93 0 top
U$2  55.5,66.93 0 top
U$3  74.55,66.93 0 top
U$4  93.6,66.93 0 top
U$5  112.65,66.93 0 top
U$6  131.7,66.93 0 top
U$7  150.75,66.93 0 top
U$8  169.8,66.93 0 top
U$9  188.85,66.93 0 top
U$10  207.9,66.93 0 top
U$11  226.95,66.93 0 top
U$12  246,66.93 0 top
U$13  269.75,66.93 0 top
U$14  41.02,47.88 0 top
U$15  60.07,47.88 0 top
U$16  79.12,47.88 0 top
U$17  98.17,47.88 0 top
U$18  117.22,47.88 0 top
U$19  136.27,47.88 0 top
U$20  155.32,47.88 0 top
U$21  174.37,47.88 0 top
U$22  193.42,47.88 0 top
U$23  212.47,47.88 0 top
U$24  231.52,47.88 0 top
U$25  50.55,28.83 0 top
U$26  69.6,28.83 0 top
U$27  88.65,28.83 0 top
U$28  107.7,28.83 0 top
U$29  126.75,28.83 0 top
U$30  145.8,28.83 0 top
U$31  164.85,28.83 0 top
U$32  183.9,28.83 0 top
U$33  202.95,28.83 0 top
U$34  222,28.83 0 top
U$35  10.41,9.78 0 top
U$36  12.7,66.93 0 top
U$37  14.86,47.88 0 top
U$38  294.39,95.12 0 top
U$39  296.67,47.88 0 top
U$40  296.67,9.78 0 top
U$41  27.43,85.98 0 top
U$42  46.48,85.98 0 top
U$43  65.53,85.98 0 top
U$44  84.58,85.98 0 top
U$45  103.63,85.98 0 top
U$46  122.68,85.98 0 top
U$47  141.73,85.98 0 top
U$48  160.78,85.98 0 top
U$49  179.83,85.98 0 top
U$50  198.88,85.98 0 top
U$51  217.93,85.98 0 top
U$52  236.98,85.98 0 top
U$53  315.72,9.78 0 top
U$54  8.38,85.98 0 top
U$55  34.29,9.78 0 top
U$56  58.17,9.78 0 top
U$57  334.77,9.78 0 top
U$58  201.17,9.78 0 top
U$59  225.04,9.78 0 top
U$60  272.8,9.78 0 top
U$61  275.08,105.03 0 top
U$62  353.82,9.78 0 top
U$63  296.67,28.83 0 top
U$64  315.72,28.83 0 top
U$65  315.72,47.88 0 top
U$66  353.82,85.98 0 top
U$67  248.92,9.78 0 top
U$68  315.72,105.03 0 top
U$69  315.72,85.98 0 top
U$70  315.72,66.93 0 top
U$71  334.77,66.93 0 top
U$72  334.77,47.88 0 top
U$73  334.77,28.83 0 top
U$74  46.48,105.03 0 top
U$75  65.53,105.03 0 top
U$76  84.58,105.03 0 top
U$77  103.63,105.03 0 top
U$78  122.68,105.03 0 top
U$79  141.73,105.03 0 top
U$80  160.78,105.03 0 top
U$81  179.83,105.03 0 top
U$82  198.88,105.03 0 top
U$83  217.93,105.03 0 top
U$84  236.98,105.03 0 top
U$85  256.03,105.03 0 top
U$86  353.82,105.03 0 top
U$87  334.77,105.03 0 top
U$88  334.77,85.98 0 top
U$89  353.82,66.93 0 top
U$90  353.82,47.88 0 top
U$91  353.82,28.83 0 top

### Tracks (layer width: path | path; a pad name or v marks a point on that pad's centre or on a via)
3.3V  (2 unrouted)
COL0  (via drill 0.35)
  Top 0.2: 293.37,107.06 293.37,106.04 v292.86,105.54
  Top 0.203: U$35.SW1 15.75,21.46 SW3.1 11.74,35.38 11.74,49.73 U$37.SW1 11.05,64.17 9.58,65.64 9.58,68.27 8.89,68.96 U$36.SW1 10.16,70.74 10.16,77.85 4.57,83.44 4.57,85.07 4.84,85.34 4.84,86.62 4.57,86.89 U$54.SW1 14.1,98.04 SW1.1 18.02,111.49 26.61,111.49 28.71,109.39 30.9,109.39 32.39,110.87 46.99,110.87 49.4,113.28 287.15,113.28 293.37,107.06
  Bottom 0.2: v292.86,105.54 293.75,104.65 293.75,101.85 301.75,93.85 U$38.19/A5
COL1
  Top 0.203: U$74.SW1 41.15,107.57 38.1,104.52 31.75,104.52 23.62,96.39 U$41.SW1 | U$14.SW1 43.05,56.26 247.75,56.26 249.01,57.52 294.01,57.52 303.53,67.04 303.53,79.63 U$38.14/A0
  Bottom 0.203: U$41.SW1 24.31,87.83 24.31,84.69 26.14,82.86 29.28,82.86 32.64,79.5 U$1.SW1 33.33,68.78 33.33,65.64 37.21,61.76 U$14.SW1 37.9,49.73 37.9,46.59 39.73,44.76 42.87,44.76 46.74,40.89 U$25.SW1 46.23,30.86 43.18,30.86 35.56,23.24 35.56,17.4 U$55.SW1
COL2
  Top 0.203: U$26.SW1 71.25,36.83 74.93,36.83 237.87,36.83 249.37,25.33 258.74,25.33 276.41,25.33 286,34.93 286,48.77 303.91,66.67 303.91,81.79 U$38.15/A1
  Bottom 0.203: U$75.SW1 61.21,107.06 59.69,107.06 57.15,104.52 57.15,98.17 49.53,98.17 42.67,91.31 U$42.SW1 43.36,87.83 43.36,84.69 45.19,82.86 48.33,82.86 51.69,79.5 U$2.SW1 52.38,68.78 52.38,65.64 56.26,61.76 U$15.SW1 56.95,49.73 56.95,46.59 58.78,44.76 61.92,44.76 65.79,40.89 U$26.SW1 64.01,31.37 59.23,26.59 59.06,26.59 58.52,26.06 58.52,25.88 54.61,21.97 54.61,12.57 U$56.SW1
COL3
  Top 0.203: SW2.1 130.43,16.89 176.04,16.89 178.57,19.42 241.29,19.42 241.3,19.43 241.77,19.43 243.73,17.47 248.85,17.47 250.81,19.43 264.16,19.43 | 264.16,19.43 | 264.16,19.43 265.57,19.43 267.63,17.37 273.56,17.37 282.42,17.37 285.75,20.7 286.51,21.46 286.51,48.51 304.29,66.29 304.29,84.84 302.89,86.23 U$38.16/A2
  Bottom 0.203: U$76.SW1 80.26,107.06 78.74,107.06 76.2,104.52 76.2,99.44 74.93,98.17 68.58,98.17 61.72,91.31 U$43.SW1 61.72,87.25 62.41,86.56 62.41,84.69 64.24,82.86 65.02,82.86 70.74,77.15 70.74,69.34 | U$27.SW1 85.22,30.99 | 85.22,30.99 85.53,30.68 85.53,27.54 94.91,18.16 120.02,18.16 SW2.1 | U$16.SW1 75.37,50.36 | 75.37,50.36 76.2,49.53 76.2,49.37 76,49.17 76,40.2 85.22,30.99 | U$3.SW1 70.74,69.34 | 70.74,69.34 71.43,68.65 71.43,54.3 75.37,50.36
COL4
  Top 0.203: U$58.SW1 201.93,16.89 204.47,16.89 204.6,16.76 283.08,16.76 287.02,20.7 287.02,48.26 294.64,55.88 304.8,66.04 304.8,85.47 302.01,88.27 U$38.17/A3
  Bottom 0.203: U$77.SW1 98.3,107.57 95.25,104.52 95.25,98.17 93.98,96.9 86.36,96.9 80.77,91.31 U$44.SW1 81.46,87.83 81.46,84.69 83.29,82.86 86.43,82.86 89.79,79.5 U$4.SW1 90.48,68.78 90.48,65.64 94.36,61.76 U$17.SW1 95.05,49.73 95.05,46.59 96.88,44.76 100.02,44.76 103.89,40.89 U$28.SW1 104.58,30.68 104.58,27.54 112.69,19.43 181.61,19.43 187.96,13.08 196.6,13.08 U$58.SW1
COL5  (via drill 0.35)
  Top 0.2: 287.65,110.36 288.42,110.36 v288.93,109.85
  Top 0.203: U$78.SW1 123.44,112.14 141.86,112.14 142.37,112.65 283.72,112.65 286,110.36 287.02,110.36 287.65,110.36
  Bottom 0.2: v288.93,109.85 292.1,106.68 292.1,91.06 U$38.25
  Bottom 0.203: U$78.SW1 117.35,107.57 114.3,104.52 114.3,99.44 113.03,98.17 105.41,98.17 99.82,92.58 U$45.SW1 99.82,86.89 100.09,86.62 100.09,85.34 99.82,85.07 99.82,78.49 U$5.SW1 109.22,69.09 109.22,65.15 113.41,60.96 U$18.SW1 114.3,49.53 114.3,49.37 114.1,49.17 114.1,46.59 114.3,46.39 114.3,40.01 U$29.SW1 123.63,30.68 123.63,27.54 130.11,21.06 194.43,21.06 203.67,11.81 208.28,11.81 210.82,9.27 214.63,9.27 217.68,12.32 U$59.SW1
COL6  (via drill 0.35)
  Top 0.2: 287.65,105.16 290.32,105.16 290.83,104.65 v290.83,104.52
  Top 0.203: U$79.SW1 142.49,112.14 283.21,112.14 284.99,110.36 284.99,106.17 286,105.16 287.65,105.16
  Bottom 0.2: v290.83,104.52 290.83,89.79 U$38.26
  Bottom 0.203: U$79.SW1 137.41,107.06 134.62,107.06 133.35,105.79 133.35,96.9 130.81,94.36 121.92,94.36 118.87,91.31 U$46.SW1 119.38,88.01 119.38,77.98 U$6.SW1 128.58,68.78 128.58,61.03 132.46,57.15 U$19.SW1 133.15,49.73 133.15,45.03 141.99,36.2 U$30.SW1 142.68,30.68 142.68,27.54 148.25,21.97 201.93,21.97 207.01,16.89 220.98,16.89 224.85,13.02 226.34,13.02 227.55,11.81 234.95,11.81 236.22,10.54 241.3,10.54 243.08,12.32 U$67.SW1
COL7
  Bottom 0.203: U$60.SW1 263.4,12.32 260.35,9.27 259.08,9.27 256.54,11.81 251.42,11.81 248.88,14.35 237.49,14.35 233.68,18.16 208.28,18.16 203.2,23.24 166.03,23.24 161.73,27.54 161.73,30.42 161.04,31.12 U$31.SW1 161.04,32.38 154.94,38.48 154.94,43.85 152.2,46.59 152.2,49.73 U$20.SW1 148.35,53.58 148.35,64.91 147.63,65.64 147.63,68.78 U$7.SW1 146.94,77.15 141.22,82.86 140.44,82.86 138.61,84.69 138.61,86.56 137.92,87.25 U$47.SW1 137.92,92.58 143.51,98.17 152.4,98.17 152.4,104.52 154.94,107.06 156.46,107.06 U$80.SW1 161.54,112.14 198.63,112.14 199.64,113.16 235.97,113.16 236.22,113.41 287.78,113.41 294.89,106.3 294.89,102.74 297.43,100.2 300.23,100.2 301.5,98.93 U$38.21/A7
COL8
  Bottom 0.203: U$40.SW1 288.8,12.32 288.29,11.81 275.3,11.81 272.76,14.35 262.89,14.35 260.35,16.89 241.3,16.89 238.76,19.43 209.55,19.43 204.47,24.51 198.12,24.51 191.77,30.86 187.96,30.86 186.87,31.95 182.6,31.95 182.03,31.37 U$32.SW1 180.09,40.89 176.22,44.76 173.08,44.76 171.25,46.59 171.25,49.73 U$21.SW1 170.56,61.76 166.68,65.64 166.68,68.78 U$8.SW1 165.99,79.5 162.63,82.86 159.49,82.86 157.66,84.69 157.66,87.83 U$48.SW1 156.97,90.04 163.83,96.9 171.45,96.9 171.45,104.52 173.99,107.06 175.51,107.06 U$81.SW1 180.21,111.76 198.75,111.76 199.64,112.65 236.22,112.65 236.6,113.03 287.02,113.03 294.26,105.79 294.26,102.36 300.23,96.39 U$38.20/A6
COL9
  Bottom 0.2: 288.8,106.29 288.8,108.97 | U$53.SW1 318.84,19.25 318.84,30.12 316.23,32.73 316.23,43.98 318.84,46.59 318.84,49.17 316.23,51.78 316.23,63.03 318.84,65.64 318.84,68.22 315.56,71.5 311.15,71.5 306.07,76.58 288.29,76.58 286.77,78.1 U$38.12
  Bottom 0.203: U$33.SW1 194.31,36.2 194.31,42.58 190.3,46.59 190.3,49.73 U$22.SW1 189.61,61.76 185.73,65.64 185.73,68.78 U$9.SW1 185.04,78.23 180.41,82.86 178.54,82.86 176.71,84.69 176.71,86.56 176.02,87.25 U$49.SW1 176.02,91.31 184.15,99.44 189.23,99.44 191.77,101.98 191.77,105.17 193.16,106.57 194.07,106.57 U$82.SW1 199.39,111.89 217.81,111.89 218.06,112.14 236.35,112.14 236.85,112.65 283.85,112.65 286.13,110.36 287.4,110.36 288.8,108.97 | 288.8,106.29 290.02,105.07 290.02,81.86 U$38.12
COL10
  Bottom 0.2: U$34.SW1 220.13,31.37 220.71,31.95 227.52,31.95 229.87,29.59 242.57,29.59 251.46,20.7 255.27,20.7 257.81,18.16 267.6,18.16 268.29,17.47 270.87,17.47 271.56,18.16 280.67,18.16 284.48,14.35 296.51,14.35 299.79,11.07 299.79,5.39 302.26,2.92 330.2,2.92 331.66,4.38 331.66,10.36 330.96,11.05 U$57.SW1 | 283.21,112.24 283.61,112.24 285.34,110.51
  Bottom 0.203: U$34.SW1 209.35,40.2 209.35,49.17 209.55,49.37 209.55,49.91 209.04,50.42 U$23.SW1 204.78,54.3 204.78,68.78 U$10.SW1 204.09,76.96 198.19,82.86 197.59,82.86 195.76,84.69 195.76,87.83 U$50.SW1 195.07,88.77 201.93,95.63 209.55,95.63 209.55,103.9 212.21,106.57 213.12,106.57 U$83.SW1 218.19,111.63 236.6,111.63 237.24,112.27 237.26,112.24 283.21,112.24 | 285.34,110.51 285.34,108.61 286.26,107.7 287.27,107.7 288.16,106.81 288.16,106.04 289.54,104.67 289.54,83.92 U$38.11
COL11
  Bottom 0.2: U$62.SW1 347.22,12.32 344.17,9.27 342.9,9.27 339.09,13.08 334.01,13.08 331.47,15.62 323.85,15.62 318.84,10.61 318.84,8.49 317.01,6.66 309.95,6.66 307.34,9.27 307.34,14.35 302.26,19.43 278.13,19.43 265.62,31.95 256.39,31.95 255.91,31.47 253.78,31.47
  Bottom 0.203: U$38.10 289.05,85.98 289.05,104.14 288.04,105.16 285.88,105.16 284.99,106.04 284.99,110.36 283.46,111.89 237.49,111.89 U$84.SW1 230.38,107.57 214.63,91.82 214.63,89.03 U$51.SW1 214.12,86.89 214.39,86.62 214.39,85.34 214.12,85.07 214.12,78.49 U$11.SW1 223.14,69.34 223.83,68.65 223.83,54.3 U$24.SW1 228.4,49.73 228.4,46.59 243.53,31.47 253.78,31.47 SW4.1
COL12
  Top 0.152: U$63.SW1 293.37,31.88 293.37,49.91 U$39.SW1
  Top 0.203: U$85.SW1 252.91,106.88 252.91,103.74 254.74,101.91 262.4,101.91 263.74,103.25 270.92,103.25 284.48,89.69 284.48,88.01 286.26,86.23 U$38.9
  Bottom 0.152: SW5.1 260.17,50.42 260.72,50.97 264.37,50.97 266.7,48.64 289.56,48.64 291.34,50.42 U$39.SW1
  Bottom 0.203: U$85.SW1 251.22,106.57 250.31,106.57 247.65,103.9 247.65,98.17 243.84,94.36 238.76,94.36 233.17,88.77 U$52.SW1 233.86,87.83 233.86,77.79 U$12.SW1 242.57,69.09 242.57,65.15 245.11,62.61 246.11,62.61 252.74,55.97 252.74,55.87 SW5.1
COL13
  Top 0.203: U$61.SW1 271.27,106.3 271.96,105.61 271.96,103.74 286.77,88.94 U$38.8
  Bottom 0.152: U$64.SW1 311.91,45.59 312.42,46.1 312.42,49.91 U$65.SW1 313.69,52.2 313.69,64.59 312.63,65.65 312.63,68.75 U$70.SW1
  Bottom 0.2: U$38.8 284.1,86.11 284.1,74.29 303.4,54.99 307.34,54.99 U$65.SW1
  Bottom 0.203: U$61.SW1 270.27,106.57 265.59,106.57 261.75,102.73 SW6.1 261.75,73.66 U$13.SW1
COL14
  Top 0.152: U$66.SW1 350.52,88.01 350.52,81.66 346.71,77.85 339.34,77.85 U$71.SW1 318.77,81.66 314.96,81.66 312.63,83.99 312.63,87.8 U$69.SW1
  Bottom 0.152: U$73.SW1 331.68,32.09 331.68,48.43 330.96,49.15 U$72.SW1 331.47,50.93 331.47,67.69 330.96,68.2 U$71.SW1 | U$38.22/A8 308.1,107.57 U$68.SW1 312.63,106.85 312.63,89.24 U$69.SW1
COL15
  Top 0.152: U$87.SW1 330.96,107.82 335.28,112.14 345.44,112.14 U$86.SW1
  Top 0.2: U$87.SW1 326.39,112.14 310.13,112.14 U$38.23/A9
  Bottom 0.152: U$89.SW1 345.44,74.04 342.34,74.04 331.68,84.7 331.68,86.53 330.96,87.25 U$88.SW1 330.96,101.47 331.47,101.98 331.47,107.06 U$87.SW1
  Bottom 0.2: U$89.SW1 350.01,68.2 350.71,67.5 350.71,51.11 U$90.SW1 350.01,49.15 350.71,48.45 350.71,32.06 U$91.SW1
GND  (2 unrouted)
N$1
  Top 0.203: U$1.SW2 40.26,70.74 D4.A
N$2
  Top 0.203: U$2.SW2 59.31,70.74 D5.A
N$3
  Top 0.203: U$3.SW2 78.36,70.74 D6.A
N$4
  Top 0.203: U$4.SW2 97.41,70.74 D7.A
N$5
  Top 0.203: U$5.SW2 120.27,72.01 D8.A
N$6
  Top 0.203: U$6.SW2 139.32,72.01 D9.A
N$7
  Top 0.203: U$7.SW2 154.56,70.74 D10.A
N$8
  Top 0.203: U$8.SW2 173.61,70.74 D11.A
N$9
  Top 0.203: U$9.SW2 192.66,70.74 D12.A
N$10
  Top 0.203: U$10.SW2 211.71,70.74 D13.A
N$11
  Top 0.203: U$11.SW2 230.76,70.74 D14.A
N$12
  Top 0.203: U$12.SW2 249.81,70.74 D15.A
N$13
  Top 0.203: U$13.SW2 273.56,70.74 D16.A
N$14
  Top 0.203: U$14.SW2 48.64,52.96 D17.A
N$15
  Top 0.203: U$15.SW2 67.69,52.96 D18.A
N$16
  Top 0.203: U$16.SW2 86.74,52.96 D19.A
N$17
  Top 0.203: U$17.SW2 105.79,52.96 D20.A
N$18
  Top 0.203: U$18.SW2 124.84,52.96 D21.A
N$19
  Top 0.203: U$19.SW2 143.89,52.96 D22.A
N$20
  Top 0.203: U$20.SW2 159.13,51.69 D23.A
N$21
  Top 0.203: U$21.SW2 178.18,51.69 D24.A
N$22
  Top 0.203: U$22.SW2 201.04,52.96 D25.A
N$23
  Top 0.203: U$23.SW2 220.09,52.96 D26.A
N$24
  Top 0.203: U$24.SW2 239.14,52.96 D27.A
N$25
  Top 0.203: U$25.SW2 54.36,32.64 D28.A
N$26
  Top 0.203: U$26.SW2 73.41,32.64 D29.A
N$27
  Top 0.203: U$27.SW2 92.46,32.64 D30.A
N$28
  Top 0.203: U$28.SW2 111.51,32.64 D31.A
N$29
  Top 0.203: U$29.SW2 130.56,32.64 D32.A
N$30
  Top 0.203: U$30.SW2 149.61,32.64 D33.A
N$31
  Top 0.203: U$31.SW2 168.66,32.64 D34.A
N$32
  Top 0.203: U$32.SW2 187.71,32.64 D35.A
N$33
  Top 0.203: U$33.SW2 206.76,32.64 D36.A
N$34
  Top 0.203: U$34.SW2 225.81,32.64 D37.A
N$35
  Top 0.203: U$60.SW2 276.48,13.72 D60.A
N$36
  Top 0.203: U$61.SW2 278.89,108.84 D61.A
N$39
  Top 0.203: SW2.2 133.1,13.97 D57.A
N$40
  Top 0.152: D97.A 358.01,91.06 U$66.SW2
N$41
  Top 0.203: U$67.SW2 256.67,14.86 D67.A
N$42
  Top 0.152: U$86.SW2 360.68,110.11 D98.A
N$44
  Top 0.203: SW1.2 26.16,110.11 27.94,108.33 36.96,108.33 D87.A
N$46
  Top 0.152: U$63.SW2 300.36,32.77 D69.A
N$47
  Top 0.152: D68.A 356.36,16.76 U$62.SW2
N$48
  Top 0.152: U$57.SW2 342.52,14.86 D66.A
N$49
  Top 0.152: U$53.SW2 320.04,13.08 D63.A
N$50
  Top 0.152: U$40.SW2 300.99,13.08 D64.A
N$51
  Top 0.203: U$36.SW2 16.51,70.74 D1.A
N$52
  Top 0.203: U$37.SW2 19.05,51.31 D2.A
N$53
  Bottom 0.203: SW3.2 23.75,32.26 D3.A
N$54
  Top 0.203: D38.A 278.73,33.19 267.73,33.19 267,33.91 SW4.2
N$55
  Top 0.203: D39.A 278.22,52.24 265.19,52.24 264.54,52.88 SW5.2
N$56
  Top 0.203: U$41.SW2 31.24,89.79 D40.A
N$57
  Top 0.203: U$42.SW2 50.29,89.79 D41.A
N$58
  Top 0.203: U$43.SW2 69.34,89.79 D42.A
N$59
  Top 0.203: U$44.SW2 88.39,89.79 D43.A
N$60
  Top 0.203: U$45.SW2 107.44,89.79 D44.A
N$61
  Top 0.203: U$46.SW2 126.49,89.79 D45.A
N$62
  Top 0.203: U$47.SW2 145.54,89.79 D46.A
N$63
  Top 0.203: U$48.SW2 164.59,89.79 D47.A
N$64
  Top 0.203: U$49.SW2 183.64,89.79 D48.A
N$65
  Top 0.203: U$50.SW2 202.69,89.79 D49.A
N$66
  Top 0.203: U$51.SW2 221.74,89.79 D50.A
N$67
  Top 0.203: U$52.SW2 240.79,89.79 D51.A
N$68
  Top 0.203: SW6.2 273.43,91.06 D52.A
N$70
  Top 0.203: U$35.SW2 14.35,13.46 D54.A
N$71
  Top 0.203: U$55.SW2 41.4,14.86 43.18,13.08 D55.A
N$72
  Top 0.203: U$56.SW2 61.98,13.59 D56.A
N$73
  Top 0.152: U$64.SW2 319.4,32.77 D70.A
N$74
  Top 0.203: U$58.SW2 208.79,14.86 D58.A
N$75
  Top 0.203: U$59.SW2 232.92,14.86 D59.A
N$76
  Top 0.152: U$73.SW2 338.45,32.77 D71.A
N$77
  Top 0.152: U$91.SW2 357.5,32.77 D72.A
N$78
  Top 0.152: U$39.SW2 300.48,51.69 D89.A
N$79
  Top 0.152: U$65.SW2 319.53,51.69 D88.A
N$80
  Top 0.152: U$72.SW2 338.58,51.69 D86.A
N$81
  Top 0.152: U$90.SW2 357.63,51.69 D73.A
N$82
  Top 0.152: U$71.SW2 338.45,70.87 D91.A
N$83
  Top 0.203: U$54.SW2 12.19,89.79 D53.A
N$84
  Top 0.152: U$89.SW2 357.63,70.74 D92.A
N$91
  Top 0.152: U$70.SW2 319.53,70.74 D90.A
N$92
  Top 0.2: U$88.SW2 342.39,91.06 D94.A
N$93
  Top 0.152: U$69.SW2 323.34,91.06 D93.A
N$95
  Top 0.152: U$68.SW2 323.34,110.11 D95.A
N$96
  Top 0.152: U$87.SW2 342.39,110.11 D96.A
N$119
  Top 0.203: U$74.SW2 54.1,110.11 D74.A
N$120
  Top 0.203: U$75.SW2 73.15,110.11 D75.A
N$121
  Top 0.203: U$76.SW2 88.39,108.84 D76.A
N$122
  Top 0.203: U$77.SW2 107.44,108.84 D77.A
N$123
  Top 0.203: U$78.SW2 126.49,108.84 D78.A
N$124
  Top 0.203: U$79.SW2 145.54,108.84 D79.A
N$125
  Top 0.203: U$80.SW2 164.59,108.84 D80.A
N$126
  Top 0.203: U$81.SW2 183.64,108.84 D81.A
N$127
  Top 0.203: U$82.SW2 202.69,108.84 D82.A
N$128
  Top 0.203: U$83.SW2 221.74,108.84 D83.A
N$129
  Top 0.203: U$84.SW2 240.79,108.84 D84.A
N$130
  Top 0.203: U$85.SW2 259.84,108.84 D85.A
ROW0
  Top 0.152: D97.C 359.92,100.58 D98.C
  Top 0.2: D97.C 354.33,99.44 356.94,102.05 356.94,106.32 355.11,108.14 354.52,108.14 349.25,113.41 300.99,113.41 295.91,108.33 295.91,105.79 293.62,103.5 290.19,103.5 289.69,104.01 U$38.2
  Top 0.203: D74.C D75.C D76.C D77.C D78.C D79.C D80.C D81.C D82.C D83.C D84.C D85.C | D61.C U$38.2
  Bottom 0.203: D87.C D74.C | D85.C D61.C
ROW1
  Top 0.152: D96.C D95.C
  Top 0.2: D95.C 318.77,94.36 304.04,94.36 303.28,95.12 293.5,95.12 292.86,95.76 292.86,99.44 290.83,101.47 U$38.3
  Top 0.203: D53.C D40.C D41.C D42.C D43.C D44.C D45.C D46.C D47.C D48.C D49.C D50.C D51.C D52.C
  Bottom 0.2: D52.C 274.7,84.58 284.48,94.36 284.48,95.63 286.51,97.66
  Bottom 0.203: U$38.3 288.16,100.08 288.16,98.17 287.65,97.66 286.51,97.66
ROW2
  Top 0.152: D93.C D94.C
  Top 0.2: D93.C 320.93,81.66 318.77,83.82 318.77,84.62 318.84,84.69 318.84,87.27 318.77,87.34 318.77,88.14 316.36,90.55 305.05,90.55 303.02,92.58 293.24,92.58 291.08,94.74 291.08,97.15 289.31,98.93 U$38.4
  Top 0.203: D16.C D15.C D14.C D13.C D12.C | D12.C 197.61,63.12 D12.C | D12.C D11.C D10.C D9.C D8.C D7.C D6.C D5.C D4.C D1.C
  Bottom 0.203: D16.C 276.86,65.15 276.86,71.5 271.78,76.58 271.78,83.56 286.77,98.55 U$38.4
ROW3  (via drill 0.35)
  Top 0.152: D92.C 344.3,63.12 D91.C 325.12,63.25 D90.C
  Top 0.2: v304.42,47.24 312.17,54.99 316.87,54.99 325.12,63.25 | D90.C 326.39,64.52 326.39,72.77 318.77,80.39 313.69,80.39 304.17,89.92 293.24,89.92 287.4,95.76 U$38.5
  Top 0.203: D2.C 49.53,43.69 D17.C D18.C D19.C D20.C D21.C D22.C D23.C D24.C D25.C D26.C D27.C 278.76,44.07 D39.C
  Bottom 0.152: D39.C 300.99,43.81 v304.42,47.24
ROW4
  Top 0.152: D73.C D86.C D88.C D89.C
  Top 0.203: D3.C 59.05,24.64 D28.C 59.94,24.51 78.74,24.51 78.74,24.77 D29.C D30.C D31.C D32.C D33.C D34.C D35.C D36.C D37.C 231.52,24.38 278.13,24.38 D38.C
  Bottom 0.152: 281.31,27.56 289.56,35.81 289.56,42.29 290.19,42.93 290.32,43.05 290.45,43.05 290.58,43.18 305.18,43.18 D89.C
  Bottom 0.2: U$38.6 282.83,89.92 282.83,73.41 302.39,53.85 306.32,53.85 307.72,52.45 307.72,45.72 D89.C
  Bottom 0.203: D38.C 281.31,27.56
ROW5
  Top 0.152: D60.C 282.45,5.46 D64.C D63.C D66.C 345.57,4.19 360.68,4.19 361.95,5.46 D68.C 362.71,19.56 D72.C D71.C D70.C D69.C
  Top 0.2: D55.C 66.93,5.84 D56.C 138.18,5.97 D57.C
  Top 0.203: D54.C D55.C | 138.18,5.97 D57.C 209.68,6.35 D58.C 233.68,5.97 D59.C 257.68,6.22 D67.C 281.69,5.97 D60.C
  Bottom 0.2: U$38.7 286.77,90.17 283.49,86.9 283.49,73.88 302.89,54.48 306.58,54.48 308.23,52.83 308.23,31.5 306.2,29.46 D69.C

### Text on the board
tPlace: TeXbrd mk2 lysandrou2018
tNames: ESC | F1 | F2 | F3 | F4 | F5 | F6 | F7 | F8 | F9 | F10 | F11 | F12 | xtra | ~ | 1 | 2 | 3 | 4 | 5 | 6 | 7 | 8 | 9 | 0 | - | + | BS | tab | q | w | e | r | t | y | u | i | o | p | [ | ] | slash | caps | a | s | d | f | g | h | j | k | l | ; | ' | enter | shift | z | x | c | v | b | n | m | < | > | ? | shift | CTRL | OS/SUPER | ALT | GREEK | FN | MATH | CTRL